# Altium project W2-FRONT.PrjPcb
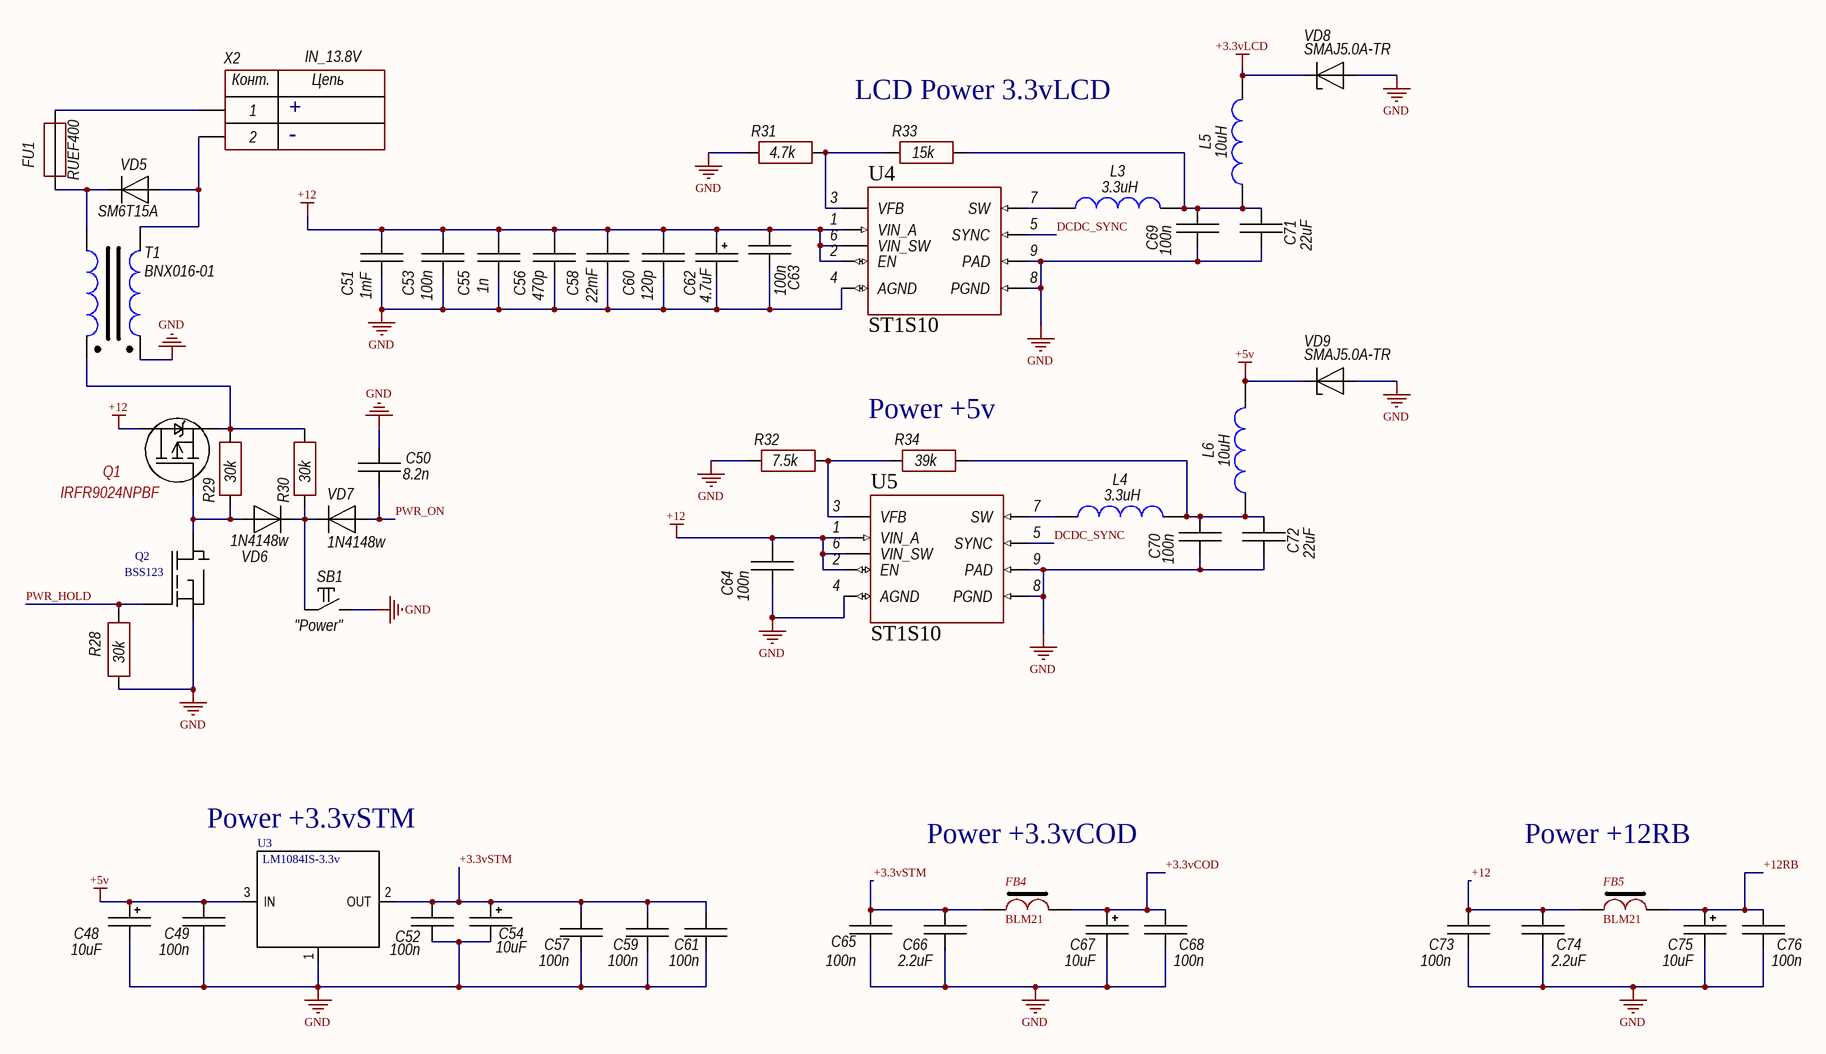
[diagram p0: Power.SchDoc]
1 sheet, 56 parts. Net scope: global (net labels, ports and power ports of the same name join across sheets).
Board file: V_08.PcbDoc

## Sheet Power.SchDoc
size 420 x 297 mm; Address1: Address1; Address2: Address2; Address3: Address3; Address4: Address4; DocumentNumber: Power FRONT 7"; SheetNumber: 2; SheetTotal: 6; Scale: 1:1; DocumentType: Схема электрическая принципиальная; FirstReferrence: АБВГ.123456.001

### Parts
C48  10uF  [TANTAL_B]
C49  100n  [CH0805C]
C50  8.2n  [CH0805C]
C51  1mF  [CH0805C]
C52  100n  [CH0805C]
C53  100n  [CH0805C]
C54  10uF  [TANTAL_B]
C55  1n  [CH0805C]
C56  470p  [CH0805C]
C57  100n  [CH0805C]
C58  22mF  [CH1210C]
C59  100n  [CH0805C]
C60  120p  [CH0805C]
C61  100n  [CH0805C]
C62  4.7uF  [D6.3C2.5H11]
C63  100n  [CH0805C]
C64  100n  [CH0805C]
C65  100n  [CH0805C]
C66  2.2uF  [CH0805C]
C67  10uF  [TANTAL_B]
C68  100n  [CH0805C]
C69  100n  [CH0805C]
C70  100n  [CH0805C]
C71  22uF  [CH1210C]
C72  22uF  [CH1210C]
C73  100n  [CH0805C]
C74  2.2uF  [CH0805C]
C75  10uF  [TANTAL_B]
C76  100n  [CH0805C]
FB4  BLM21  [CH0805L]
FB5  BLM21  [CH0805L]
FU1  RUEF400  [Fuse: Ruef400]
L3  3.3uH  [IND: CDRH74]
L4  3.3uH  [IND: CDRH74]
L5  10uH  [IND: CDRH74]
L6  10uH  [IND: CDRH74]
Q1  IRFR9024NPBF  [D2PAK_132]
Q2  BSS123  [SOT23_132]
R28  30k  [CH0805R]
R29  30k  [CH0805R]
R30  30k  [CH0805R]
R31  4.7k  [CH0805R]
R32  7.5k  [CH0805R]
R33  15k  [CH0805R]
R34  39k  [CH0805R]
SB1  "Power"  [BUT: 6x6]
T1  BNX016-01  [BNX016-01]
U3  LM1084IS-3.3v  [TO-263-3(123)]
U4  ST1S10  [8-SOIC (PAD)]
U5  ST1S10  [8-SOIC (PAD)]
VD5  SM6T15A  [SMB]
VD6  1N4148w  [SOD123F]
VD7  1N4148w  [SOD123F]
VD8  SMAJ5.0A-TR  [SMA]
VD9  SMAJ5.0A-TR  [SMA]
X2  IN_13.8V  [CON: WF-02]

### Nets
+3.3vLCD: L5.1 VD8.2(C)
+5v: C48.1 C49.2 L6.1 U3.3(IN) VD9.2(C)
+12: C51.2 C53.2 C55.2 C56.2 C58.2 C60.2 C62.1 C63.2 C64.2 C73.2 C74.2 FB5.2 Q1.3(Сток(Drain)) U4.1(VIN_A) U4.2(EN) U4.6(VIN_SW) U5.1(VIN_A) U5.2(EN) U5.6(VIN_SW)
GND: C48.2 C49.1 C50.2 C51.1 C52.1 C53.1 C54.2 C55.1 C56.1 C57.1 C58.1 C59.1 C60.1 C61.1 C62.2 C63.1 C64.1 C65.1 C66.1 C67.2 C68.1 C69.1 C70.1 C71.1 C72.1 C73.1 C74.1 C75.2 C76.1 Q2.2(S) R28.1 R31.1 R32.1 SB1.2 T1.3 U3.1 U4.4(AGND) U4.8(PGND) U4.9(PAD) U5.4(AGND) U5.8(PGND) U5.9(PAD) VD8.1(A) VD9.1(A)
+3.3vCOD: C67.1 C68.2 FB4.1
+3.3vSTM: C52.2 C54.1 C57.2 C59.2 C61.2 C65.2 C66.2 FB4.2 U3.2(OUT)
+12RB: C75.1 C76.2 FB5.1
DCDC_SYNC: U4.5(SYNC) U5.5(SYNC)
PWR_HOLD: Q2.1(G) R28.2
PWR_ON: C50.1 VD7.1
NetC69_2: C69.2 C71.2 L3.1 L5.2 R33.2
NetC70_2: C70.2 C72.2 L4.1 L6.2 R34.2
NetFU1_1: FU1.1 T1.2 VD5.2
NetFU1_2: FU1.2 X2.1
NetL3_2: L3.2 U4.7(SW)
NetL4_2: L4.2 U5.7(SW)
NetQ1_1: Q1.1(Затвор(Gate)) Q2.3(D) R29.1 VD6.1
NetQ1_2: Q1.2(I) R29.2 R30.2 T1.1
NetR30_1: R30.1 SB1.1 VD6.2 VD7.2
NetR31_2: R31.2 R33.1 U4.3(VFB)
NetR32_2: R32.2 R34.1 U5.3(VFB)
NetT1_4: T1.4 VD5.1 X2.2

### Notes on the sheet
- +
- -
- LCD Power 3.3vLCD
- (near R34) Power +5v
- Power +3.3vSTM
- Power +3.3vCOD
- Power +12RB
- Подп. и дата
- Инв. № дубл.
- Взам. инв. №
- Инв. № подл.
- Изм.
- Лист
- № докум.
- Подп.
- Дата
- 2.106-A3
- Копировал
- Формат А3
- (in symbol 2-Connector) Конт.; Цепь

### Library data of the parts
C48 C54 C67 C75 = TantalCap: Manufacturer: *; Model: *; HelpURL: *; ComponentKind: *; Value: *
C49-C53 C55-C61 C63-C66 C68-C74 C76 = Capacitor: Manufacturer: *; Model: *; HelpURL: *; ComponentKind: *; Value: *
C62 = AlumCap: Manufacturer: *; Model: *; HelpURL: *; ComponentKind: *; Value: *
FB4 FB5 = FB-1
FU1 = Fuse: Manufacturer: *; Model: *; HelpURL: *; ComponentKind: *; Value: *
L3-L6 = Inductor: Manufacturer: *; Model: *; HelpURL: *; ComponentKind: *; Value: *
Q1 = P-KANAL
R28-R34 = Resistor: Manufacturer: *; Model: *; HelpURL: *; ComponentKind: *; Value: *
SB1 = Tactile switches: 6x6 mm; Manufacturer: *; Model: *; HelpURL: *; ComponentKind: *
T1 = EMI bead: Manufacturer: Murata Electronics North America; Model: DLW21SN900SQ2L; HelpURL: https://www.digikey.com/product-detail/en/murata-electronics-north-america/DLW21SN900SQ2L/490-5137-1-ND/1922888; ComponentKind: Bead
U3 = LM1084
VD5-VD7 = Diod: ComponentKind: *; Manufacturer: *; Model: *; HelpURL: *
VD8 VD9 = Diod Zener: ComponentKind: *; Manufacturer: *; Model: *; HelpURL: *
X2 = 2-Connector: Model: *; Manufacturer: *; HelpURL: *; ComponentKind: *